# Altium schematic sheet 3_MCU.schdoc
size 309 x 223 mm; Symbol: Sheet-Symbol_A4; Device: Sheet-Symbol_A4; Company: EasyEDA.com; Drawed: EasyEDA Pro; Reviewed: EasyEDA Pro; Version: V0.1; Page Size: A4; @Project Name: TUD-EnergyHarvestingConsole_2022-08-29_17-01-09; @Page Count: 5; @Update Date: 2023-01-27; @Create Date: 2023-01-05; @Schematic Name: Schematic2; Part Number: JLCPCB-002; @Page No: 1; @Page Name: MCU
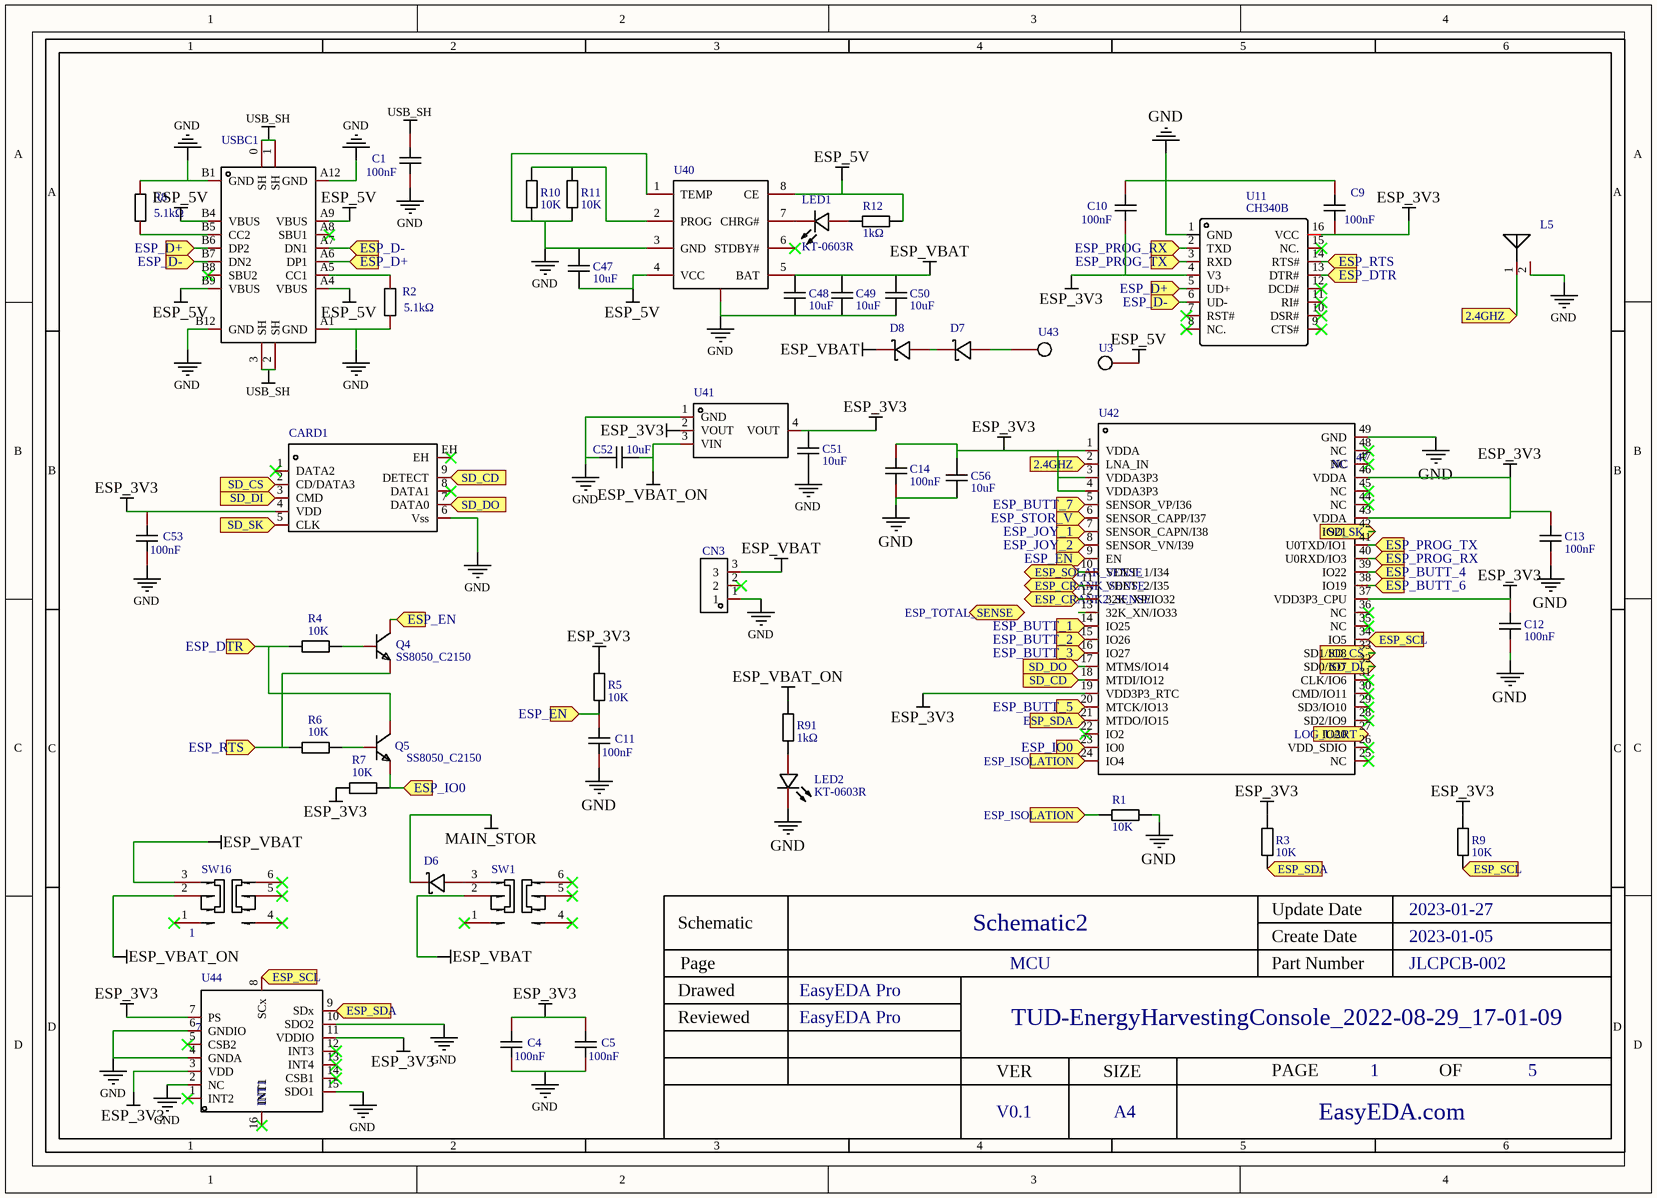
[diagram p0: 3_MCU.schdoc]

## Parts
C1  100nF  [C0603]
C4  100nF  [C0603]
C5  100nF  [C0603]
C9  100nF  [C0603]
C10  100nF  [C0603]
C11  100nF  [C0603]
C12  100nF  [C0402_NEW]
C13  100nF  [C0402_NEW]
C14  100nF  [C0402_NEW]
C47  10uF  [C0402]
C48  10uF  [C0402]
C49  10uF  [C0402]
C50  10uF  [C0402]
C51  10uF  [C0402]
C52  10uF  [C0402]
C53  100nF  [C0603]
C56  10uF  [C0402]
CARD1  473521001  [SD-SMD_SD-47352-101]  (value not drawn)
CN3  X1502WR-03K-N0SN  [CONN-TH_3P-P1.50_X1502WR-03K-N0SN]  (value not drawn)
D6  SS54  [SMA_L4.4-W2.8-LS5.4-R-RD]  (value not drawn)
D7  SS54  [SMA_L4.4-W2.8-LS5.4-R-RD]  (value not drawn)
D8  SS54  [SMA_L4.4-W2.8-LS5.4-R-RD]  (value not drawn)
L5  SLDA92-2R660G-S1TF  [ANT-SMD_L9.00-W2.00]  (value not drawn)
LED1  KT-0603R  [LED0603-R-RD]
LED2  KT-0603R  [LED0603-R-RD]
Q4  SS8050_C2150  [SOT-23-3_L2.9-W1.3-P1.90-LS2.4-BR]
Q5  SS8050_C2150  [SOT-23-3_L2.9-W1.3-P1.90-LS2.4-BR]
R1  10K  [R0603]
R2  5.1kΩ  [R0603]
R3  10K  [R0603]
R4  10K  [R0603]
R5  10K  [R0603]
R6  10K  [R0603]
R7  10K  [R0603]
R8  5.1kΩ  [R0603]
R9  10K  [R0603]
R10  10K  [R0603]
R11  10K  [R0603]
R12  1kΩ  [R0603]
R91  1kΩ  [R0603]
SW1  SS-3235S-L1  [SW-SMD_SS-3235S-LX]  (value not drawn)
SW16  NUMBER: 1  [SW-SMD_SS-3235S-LX]  (hidden comment: SS-3235S-L1)
U3  SMD_PAD  [SMD_PAD]  (value not drawn)
U11  CH340B  [SOIC-16_L9.9-W3.9-P1.27-LS6.0-BL]
U40  TP4056M  [MSOP-8_L3.0-W3.0-P0.65-LS5.0-BL-EP]  (value not drawn)
U41  AMS1117-3.3  [SOT-223-3_L6.5-W3.4-P2.30-LS7.0-BR]  (value not drawn)
U42  NAME: NC  NUMBER: 47  [LGA-48_L7.0-W7.0-P0.50-BL-EP5.0]  (hidden comment: ESP32-PICO-V3)
U43  SMD_PAD  [SMD_PAD]  (value not drawn)
U44  NAME: INT1  NUMBER: 7  [LGA-16_L4.5-W3.0-P0.50-BL]  (hidden comment: BMI055)
USBC1  TYPE-C-31-M-12  [USB-C_SMD-TYPE-C-31-M-12]  (value not drawn)

## Ports
2.4GHZ (in), ESP_BUTT_1 (in), ESP_BUTT_2 (in), ESP_BUTT_3 (in), ESP_BUTT_4 (in), ESP_BUTT_5 (in), ESP_BUTT_6 (in), ESP_BUTT_7 (in), ESP_CRANK2_SENSE (bidir), ESP_CRANK_SENSE (bidir), ESP_D+ (in), ESP_D- (in), ESP_DTR (in), ESP_EN (in), ESP_IO0 (in), ESP_ISOLATION (in), ESP_JOY_1 (in), ESP_JOY_2 (in), ESP_PROG_RX (in), ESP_PROG_TX (in), ESP_RTS (in), ESP_SCL (in), ESP_SDA (in), ESP_SOLAR_SENSE (bidir), ESP_STOR_V (in), ESP_TOTAL_SENSE (bidir), LOG_UART (in), SD_CD (in), SD_CS (in), SD_DI (in), SD_DO (in), SD_SK (in)

## Nets
ESP_3V3: C4.2 C5.2 C9.1 C10.1 C12.2 C13.2 C14.2 C51.1 C53.2 C56.1 CARD1.4(VDD) R3.2 R5.2 R7.2 R9.2 U11.4(V3) U11.16(VCC) U41.2(VOUT) U41.4(VOUT) U42.1(VDDA) U42.3(VDDA3P3) U42.4(VDDA3P3) U42.19(VDD3P3_RTC) U42.37(VDD3P3_CPU) U42.43(VDDA) U42.46(VDDA) U44.3(VDD) U44.7(PS) U44.11(VDDIO)
ESP_5V: C47.2 R12.2 U3.1 U40.4(VCC) U40.8(CE) USBC1.A4(VBUS) USBC1.A9(VBUS) USBC1.B4(VBUS) USBC1.B9(VBUS)
ESP_VBAT: C48.1 C49.1 C50.1 CN3.3 D8.2(K) SW1.2 SW16.3 U40.5(BAT)
ESP_VBAT_ON: C52.2 R91.2 SW16.2 U41.3(VIN)
GND: C1.1 C4.1 C5.1 C9.2 C10.2 C11.1 C12.1 C13.1 C14.1 C47.1 C48.2 C49.2 C50.2 C51.2 C52.1 C53.1 C56.2 CARD1.6(Vss) CN3.1 L5.2(NC) LED2.2(K) R1.1 R2.1 R8.2 R10.1 R11.1 U11.1(GND) U40.1(TEMP) U40.3(GND) U40.9 U41.1(GND) U42.49(GND) U44.2(NC) U44.4(GNDA) U44.6(GNDIO) U44.10(SDO2) U44.15(SDO1) USBC1.A1(GND) USBC1.A12(GND) USBC1.B1(GND) USBC1.B12(GND)
MAIN_STOR: D6.2(K)
USB_SH: C1.2 USBC1.0(SH) USBC1.1(SH) USBC1.2(SH) USBC1.3(SH)
2.4GHZ: L5.1 U42.2(LNA_IN) ; port 2.4GHZ
ESP_BUTT_1: U42.14(IO25) ; port ESP_BUTT_1
ESP_BUTT_2: U42.15(IO26) ; port ESP_BUTT_2
ESP_BUTT_3: U42.16(IO27) ; port ESP_BUTT_3
ESP_BUTT_4: U42.39(IO22) ; port ESP_BUTT_4
ESP_BUTT_5: U42.20(MTCK/IO13) ; port ESP_BUTT_5
ESP_BUTT_6: U42.38(IO19) ; port ESP_BUTT_6
ESP_BUTT_7: U42.5(SENSOR_VP/I36) ; port ESP_BUTT_7
ESP_CRANK2_SENSE: U42.12(32K_XP/IO32) ; port ESP_CRANK2_SENSE
ESP_CRANK_SENSE: U42.11(VDET_2/I35) ; port ESP_CRANK_SENSE
ESP_D+: U11.5(UD+) USBC1.A6(DP1) USBC1.B6(DP2) ; port ESP_D+
ESP_D-: U11.6(UD-) USBC1.A7(DN1) USBC1.B7(DN2) ; port ESP_D-
ESP_DTR: Q5.3(C) R4.1 U11.13(DTR#) ; port ESP_DTR
ESP_EN: C11.2 Q4.3(C) R5.1 U42.9(EN) ; port ESP_EN
ESP_IO0: Q5.2(E) R7.1 U42.23(IO0) ; port ESP_IO0
ESP_ISOLATION: R1.2 U42.24(IO4) ; port ESP_ISOLATION
ESP_JOY_1: U42.7(SENSOR_CAPN/I38) ; port ESP_JOY_1
ESP_JOY_2: U42.8(SENSOR_VN/I39) ; port ESP_JOY_2
ESP_PROG_RX: U11.2(TXD) U42.40(U0RXD/IO3) ; port ESP_PROG_RX
ESP_PROG_TX: U11.3(RXD) U42.41(U0TXD/IO1) ; port ESP_PROG_TX
ESP_RTS: Q4.2(E) R6.1 U11.14(RTS#) ; port ESP_RTS
ESP_SCL: R9.1 U42.34(IO5) U44.8(SCx) ; port ESP_SCL
ESP_SDA: R3.1 U42.21(MTDO/IO15) U44.9(SDx) ; port ESP_SDA
ESP_SOLAR_SENSE: U42.10(VDET_1/I34) ; port ESP_SOLAR_SENSE
ESP_STOR_V: U42.6(SENSOR_CAPP/I37) ; port ESP_STOR_V
LOG_UART: U42.27(IO20) ; port LOG_UART
SD_CD: CARD1.9(DETECT) U42.18(MTDI/IO12) ; port SD_CD
SD_CS: CARD1.2(CD/DATA3) U42.33(SD1/IO8) ; port SD_CS
SD_DI: CARD1.3(CMD) U42.32(SD0/IO7) ; port SD_DI
SD_DO: CARD1.7(DATA0) U42.17(MTMS/IO14) ; port SD_DO
SD_SK: CARD1.5(CLK) U42.42(IO21) ; port SD_SK
NetD6_1: D6.1(A) SW1.3
NetD7_1: D7.1(A) U43.1
NetD7_2: D7.2(K) D8.1(A)
NetLED1_1: LED1.1(A) R12.1
NetLED1_2: LED1.2(K) U40.7(CHRG#)
NetLED2_1: LED2.1(A) R91.1
NetQ4_1: Q4.1(B) R4.2
NetQ5_1: Q5.1(B) R6.2
NetR2_2: R2.2 USBC1.A5(CC1)
NetR8_1: R8.1 USBC1.B5(CC2)
NetR10_2: R10.2 R11.2 U40.2(PROG)

Not connected (* = marked no-connect by the designer): CARD1 1(DATA2)* 8(DATA1)* EH*; CN3 2*; SW1 1* 4* 5* 6*; SW16 1* 4* 5* 6*; U11 7(RST#)* 8(NC.)* 9(CTS#)* 10(DSR#)* 11(RI#)* 12(DCD#)* 15(NC.)*; U40 6(STDBY#)*; U42 13(32K_XN/IO33) 22(IO2)* 25(NC)* 26(VDD_SDIO)* 28(SD2/IO9)* 29(SD3/IO10)* 30(CMD/IO11)* 31(CLK/IO6)* 35(NC)* 36(NC)* 44(NC)* 45(NC)* 47(NC)* 48(NC)*; U44 1(INT2)* 5(CSB2)* 12(INT3)* 13(INT4)* 14(CSB1)* 16(INT1)*; USBC1 A8(SBU1)* B8(SBU2)*

## Notes on the sheet
- 1
- 2
- 3
- 4
- 5
- 6
- A
- B
- C
- Schematic
- Schematic2
- Create Date
- Update Date
- 2023-01-27
- 2023-01-05
- Reviewed
- Drawed
- Page
- EasyEDA Pro
- MCU
- Part Number
- TUD-EnergyHarvestingConsole_2022-08-29_17-01-09
- JLCPCB-002
- D
- VER
- SIZE
- PAGE
- OF
- V0.1
- A4
- EasyEDA.com

## Library data of the parts
C1 C4 C5 C9-C11 C53 = CC0603KRX7R9BB104: Manufacturer: YAGEO; Convert to PCB: yes; NAME: 2; Name: 100nF; Symbol: 100nF; Device: CC0603KRX7R9BB104; Supplier: LCSC; Manufacturer Part: CC0603KRX7R9BB104; Supplier Part: C14663; JLCPCB Part Class: Basic; Add into BOM: yes; Origin Footprint: C0603; NUMBER: 2
C12-C14 = CL05B104KO5NNNC: Manufacturer: SAMSUNG; Convert to PCB: yes; Name: 100nF; Symbol: 100nF; Device: CL05B104KO5NNNC; Supplier: LCSC; Manufacturer Part: CL05B104KO5NNNC; Supplier Part: C1525; JLCPCB Part Class: Basic Part; Add into BOM: yes; Origin Footprint: C0402_NEW
C47-C50 C52 C56 = CL05A106MQ5NUNC: Manufacturer: SAMSUNG; Convert to PCB: yes; Name: 10uF; Symbol: 10uF; Device: CL05A106MQ5NUNC; Supplier: LCSC; Manufacturer Part: CL05A106MQ5NUNC; Supplier Part: C15525; JLCPCB Part Class: Basic Part; Add into BOM: yes; Origin Footprint: C0402
C51 = CL05A106MQ5NUNC: Manufacturer: SAMSUNG; Convert to PCB: yes; NAME: 2; Name: 10uF; Symbol: 10uF; Device: CL05A106MQ5NUNC; Supplier: LCSC; Manufacturer Part: CL05A106MQ5NUNC; Supplier Part: C15525; JLCPCB Part Class: Basic Part; Add into BOM: yes; Origin Footprint: C0402; NUMBER: 2
CARD1 = 473521001: Card Connection Mode:Self bomb Card Type:- Connector Type:Deck Maximum Body Height:- Contact Material:- Contact Plating:- Operating Temperature Range:- Operating Temperature Range:- Welding Temperature (Max):-; Manufacturer: MOLEX; Add into BOM: yes; Connector Type: Deck; Name: 473521001; Symbol: 473521001; Device: 473521001; LCSC Part Name: 自弹式 卡座; Supplier Part: C293569; Manufacturer Part: 473521001; Supplier Footprint: SMD; JLCPCB Part Class: Extended Part; Datasheet: https://atta.szlcsc.com/upload/public/pdf/source/20181030/C293569_7F106D9D5824A4291603A741C7726EB4.pdf; Supplier: LCSC; Convert to PCB: yes; Card Connection Mode: Self bomb; Card Type: -; Maximum Body Height: -; Contact Material: -; Contact Plating: -; Operating Temperature Range: -; Welding Temperature (Max): -
CN3 = X1502WR-03K-N0SN: Reference Series:ZH Pitch:1.5mm Pins Structure:1x3P Number of Rows:1 Number of PINs Per Row:3 Row Spacing:- Gender:母型插口 Mounting Style:- Contact Material:黄铜 Contact Plating:锡 Operating Temperature Range:-25~+85 Operating Temperature Range:-25~+85 Weld; Manufacturer: XKB Connectivity(中国星坤); Add into BOM: yes; Reference Series: ZH; Pitch: 1.5mm; Pins Structure: 1x3P; Number of PINs Per Row: 3; Gender: 母型插口; Welding Temperature (Max): 260; Symbol: X1502WR-03K-N0SN; Device: X1502WR-03K-N0SN; LCSC Part Name: ZH 1.5mm 1x3P; Supplier Part: C561535; Manufacturer Part: X1502WR-03K-N0SN; Supplier Footprint: 插件,P=1.5mm; JLCPCB Part Class: Extended Part; Datasheet: https://atta.szlcsc.com/upload/public/pdf/source/20211011/A8F56EA81CC8259D7C16F37B4C6DCC36.pdf; Supplier: LCSC; Convert to PCB: yes; Number of Rows: 1; Row Spacing: -; Mounting Style: -; Contact Material: 黄铜; Contact Plating: 锡; Operating Temperature Range: -25~+85
D6-D8 = SS54: Reverse Voltage (Vr):40V Average Rectified Current (Io):5A Forward Voltage (Vf@If):550mV@5A; Manufacturer: MDD; Symbol: SS54_C22452; Add into BOM: yes; Reverse Voltage (Vr): 40V; Average Rectified Current (Io): 5A; Device: SS54; LCSC Part Name: 40V 5A 550mV@5A; Supplier Part: C22452; Manufacturer Part: SS54; Supplier Footprint: SMA(DO-214AC); JLCPCB Part Class: Basic Part; Datasheet: https://atta.szlcsc.com/upload/public/pdf/source/20190306/C22452_DC5E4F74C3B638F6D8E4C7650D5BF30E.pdf; Supplier: LCSC; Convert to PCB: yes; Forward Voltage (Vf@If): 550mV@5A
L5 = SLDA92-2R660G-S1TF: RF Family/Standard:- Frequency Group:- Frequency (Center/Band):- Frequency Range:- Antenna Type:- Number of Bands:- VSWR (Max):- Return Loss (Min):- Gain:- Power Max:- Termination:- Mounting Type:- Height (Max):-; Manufacturer: Sunlord(顺络); Add into BOM: yes; Symbol: SLDA92-2R660G-S1TF; Device: SLDA92-2R660G-S1TF; LCSC Part Name: 叠层片式天线2660MHZ; Supplier Part: C361625; Manufacturer Part: SLDA92-2R660G-S1TF; Supplier Footprint: SMD,9x2mm; JLCPCB Part Class: Extended Part; Datasheet: https://atta.szlcsc.com/upload/public/pdf/source/20210916/4D4E9941A1EC6D8EB189782323A655A4.pdf; Supplier: LCSC; Convert to PCB: yes; RF Family/Standard: -; Frequency Group: -; Frequency (Center/Band): -; Frequency Range: -; Antenna Type: -; Number of Bands: -; VSWR (Max): -; Return Loss (Min): -; Gain: -; Power Max: -; Termination: -; Mounting Type: -; Height (Max): -
LED1 LED2 = KT-0603R: Manufacturer: KENTO; Convert to PCB: yes; Name: KT-0603R; Symbol: KT-0603R; Device: KT-0603R; Supplier: LCSC; Manufacturer Part: KT-0603R; Supplier Part: C2286; JLCPCB Part Class: Basic Part; Add into BOM: yes; Origin Footprint: LED0603-R-RD
Q4 = SS8050: Manufacturer: CJ; Convert to PCB: yes; Name: SS8050_C2150; Symbol: SS8050_C2150; Device: SS8050; Supplier: LCSC; Manufacturer Part: SS8050; Supplier Part: C2150; JLCPCB Part Class: Basic Part; Add into BOM: yes; Origin Footprint: SOT-23-3_L2.9-W1.3-P1.90-LS2.4-BR
Q5 = SS8050: Manufacturer: CJ; Convert to PCB: yes; NAME: E; NUMBER: 2; Pin Type: IN; Name: SS8050_C2150; Symbol: SS8050_C2150; Device: SS8050; Supplier: LCSC; Manufacturer Part: SS8050; Supplier Part: C2150; JLCPCB Part Class: Basic Part; Add into BOM: yes; Origin Footprint: SOT-23-3_L2.9-W1.3-P1.90-LS2.4-BR
R1 R3-R7 R9-R11 = 0603WAF1002T5E: Manufacturer: UniOhm; Convert to PCB: yes; Name: 10K; Symbol: 10K; Device: 0603WAF1002T5E; Supplier: LCSC; Manufacturer Part: 0603WAF1002T5E; Supplier Part: C25804; JLCPCB Part Class: Basic; Add into BOM: yes; Origin Footprint: R0603
R2 R8 = 0603WAF5101T5E: Type:Thick Film Resistors Resistance: Tolerance:±1% Tolerance:±1% Power(Watts): Temperature Coefficient:±100ppm/℃ Temperature Coefficient:±100ppm/℃ Overload Voltage (Max): Operating Temperature Range:-55℃~+155℃ Operating Temperature Range:-55℃~+155℃; Manufacturer: UNI-ROYAL(厚声); Add into BOM: yes; Tolerance: ±1%; Name: 5.1kΩ; Symbol: 0603WAF5101T5E; Device: 0603WAF5101T5E; LCSC Part Name: 5.1kΩ ±1% 100mW; Supplier Part: C23186; Manufacturer Part: 0603WAF5101T5E; Supplier Footprint: 0603; JLCPCB Part Class: Basic Part; Datasheet: https://atta.szlcsc.com/upload/public/pdf/source/20200306/C422600_1E6D84923E4A46A82E41ADD87F860B5C.pdf; Supplier: LCSC; Convert to PCB: yes; Type: Thick Film Resistors; Value: 5.1kΩ; Temperature Coefficient: ±100ppm/℃; Operating Temperature Range: -55℃~+155℃
R12 = 0603WAF1001T5E: Manufacturer: UniOhm; Resistance: 1K; Convert to PCB: yes; Name: 1kΩ; Symbol: 1kΩ; Device: 0603WAF1001T5E; Supplier: LCSC; Manufacturer Part: 0603WAF1001T5E; Supplier Part: C21190; JLCPCB Part Class: Basic Part; Add into BOM: yes; Origin Footprint: R0603
R91 = 0603WAF1001T5E: Manufacturer: UniOhm; Resistance: 1K; Convert to PCB: yes; NAME: 1; Name: 1kΩ; Symbol: 1kΩ; Device: 0603WAF1001T5E; Supplier: LCSC; Manufacturer Part: 0603WAF1001T5E; Supplier Part: C21190; JLCPCB Part Class: Basic Part; Add into BOM: yes; Origin Footprint: R0603; NUMBER: 1
SW1 SW16 = SS-3235S-L1: Current Rating (DC):50mA Voltage Rating (DC):12V Current Rating (AC):50mA Voltage Rating (AC):12V Circuit:双刀双掷 Mounting Style:卧贴 Mechanical Life:10000 Actuator Color:黑色 Actuator Style:矩形柱状 Pin Style:鸥翼型 Operating Temperature:-40℃~+85℃ Operating Temperatur; Manufacturer: XKB Connectivity(中国星坤); Add into BOM: yes; Current Rating (DC): 50mA; Voltage Rating (DC): 12V; Circuit: 双刀双掷; Mechanical Life: 10000; Actuator Color: 黑色; Actuator Style: 矩形柱状; Pin Style: 鸥翼型; Switch Length: 9.1mm; Switch Width: 3.55mm; Switch Height: 3.2mm; Name: SS-3235S-L1; Symbol: SS-3235S-L1; Device: SS-3235S-L1; LCSC Part Name: W9.1xD3.55xH3.3 6脚立式贴片两档小拨动开关柄高2MM; Supplier Part: C500055; Manufacturer Part: SS-3235S-L1; Supplier Footprint: SMD; JLCPCB Part Class: Extended Part; Datasheet: https://atta.szlcsc.com/upload/public/pdf/source/20211011/39D516E750C13BE9339464E723D9F132.pdf; Supplier: LCSC; Convert to PCB: yes; Current Rating (AC): 50mA; Voltage Rating (AC): 12V; Mounting Style: 卧贴; Operating Temperature: -40℃~+85℃
U11 = CH340B: Manufacturer: WCH; Convert to PCB: yes; Name: CH340B; Symbol: CH340B; Device: CH340B; Supplier: LCSC; Manufacturer Part: CH340B; Supplier Part: C81010; JLCPCB Part Class: Extended Part; Add into BOM: yes; Origin Footprint: SOIC-16_L9.9-W3.9-P1.27-LS6.0-BL
U40 = TP4056M: Battery Chemistry:- Number of Cells:- Charge Current - Max:- Battery Pack Voltage:- Voltage - Supply (Max):- Interface:-; Manufacturer: TOPPOWER(南京拓微); Add into BOM: yes; Symbol: TP4056M; Device: TP4056M; LCSC Part Name: TP4056M; Supplier Part: C21417; Manufacturer Part: TP4056M; Supplier Footprint: MSOP-8PP; JLCPCB Part Class: Extended Part; Datasheet: https://atta.szlcsc.com/upload/public/pdf/source/20160713/1468379850451.pdf; Supplier: LCSC; Convert to PCB: yes; Battery Chemistry: -; Number of Cells: -; Charge Current - Max: -; Battery Pack Voltage: -; Voltage - Supply (Max): -; Interface: -
U41 = AMS1117-3.3: Output Type: Output Polarity:Positive Number of Outputs:1 Maximum Input Voltage:- Output Voltage:3.3V~3.3V Output Voltage:3.3V~3.3V Dropout Voltage:1.3V@(800mA) Quiescent Current (Ground Current):- Output Current:1A Power Supply Rejection Ratio (PSRR):72d; Manufacturer: 美国AMS; Add into BOM: yes; Number of Outputs: 1; Output Current: 1A; Power Supply Rejection Ratio (PSRR): 72dB@(120Hz); Symbol: AMS1117-3.3; Device: AMS1117-3.3; LCSC Part Name: Vout=3.3V 1A 72dB@(120Hz); Supplier Part: C6186; Manufacturer Part: AMS1117-3.3; Supplier Footprint: SOT-223; JLCPCB Part Class: Basic Part; Datasheet: https://atta.szlcsc.com/upload/public/pdf/source/20180727/C6186_7A095716F0823C02F1997A905E26C086.pdf; Supplier: LCSC; Convert to PCB: yes; Output Polarity: Positive; Maximum Input Voltage: -; Output Voltage: 3.3V~3.3V; Dropout Voltage: 1.3V@(800mA); Quiescent Current (Ground Current): -; Noise: -; Feature: -; Operating Temperature: -
U42 = ESP32-PICO-V3: Manufacturer: ESPRESSIF(乐鑫); Add into BOM: yes; Symbol: ESP32-PICO-V3; Device: ESP32-PICO-V3; LCSC Part Name: ESP32-PICO-V3; Supplier Part: C967022; Manufacturer Part: ESP32-PICO-V3; Supplier Footprint: LGA-48; JLCPCB Part Class: Extended Part; Datasheet: https://atta.szlcsc.com/upload/public/pdf/source/20201204/C967022_70D5B60C6775BC6940328D9322B3B8D9.pdf; Supplier: LCSC; Convert to PCB: yes
U44 = BMI055: Manufacturer: Bosch(博世); Add into BOM: yes; Name: BMI055; Symbol: BMI055; Device: BMI055; LCSC Part Name: BMI055; Supplier Part: C189620; Manufacturer Part: BMI055; Supplier Footprint: LGA-16(3x4.5); JLCPCB Part Class: Extended Part; Datasheet: https://atta.szlcsc.com/upload/public/pdf/source/20180329/C189620_E48E08509977766D64AFF6E81107ACD7.pdf; Supplier: LCSC; Convert to PCB: yes
USBC1 = TYPE-C-31-M-12: Connector Type:Type-C Standard:- Gender:Female Number of Contacts:16 Number of Ports:1 Mounting Style:- Current Rating - Power (Max):5A Contact Material:- Contact Plating:- Operating Temperature Range:- Operating Temperature Range:- Welding Temperature (M; Manufacturer: 韩国韩荣; Add into BOM: yes; Connector Type: Type-C; Gender: Female; Number of Contacts: 16; Number of Ports: 1; Current Rating - Power (Max): 5A; Name: TYPE-C-31-M-12; Symbol: TYPE-C-31-M-12; Device: TYPE-C-31-M-12; LCSC Part Name: Type-C 母座; Supplier Part: C165948; Manufacturer Part: TYPE-C-31-M-12; Supplier Footprint: SMD; JLCPCB Part Class: Extended Part; Datasheet: https://atta.szlcsc.com/upload/public/pdf/source/20220525/466408E853115E789EDB0DDC29077C05.pdf; Supplier: LCSC; Convert to PCB: yes; Standard: -; Mounting Style: -; Contact Material: -; Contact Plating: -; Operating Temperature Range: -; Welding Temperature (Max): -
U3 U43 = SMD_PAD: Symbol: SMD_PAD; Device: SMD_PAD